# EAGLE schematic cap_pcb (EAGLE 9.6.2)
Assembly variants: basic
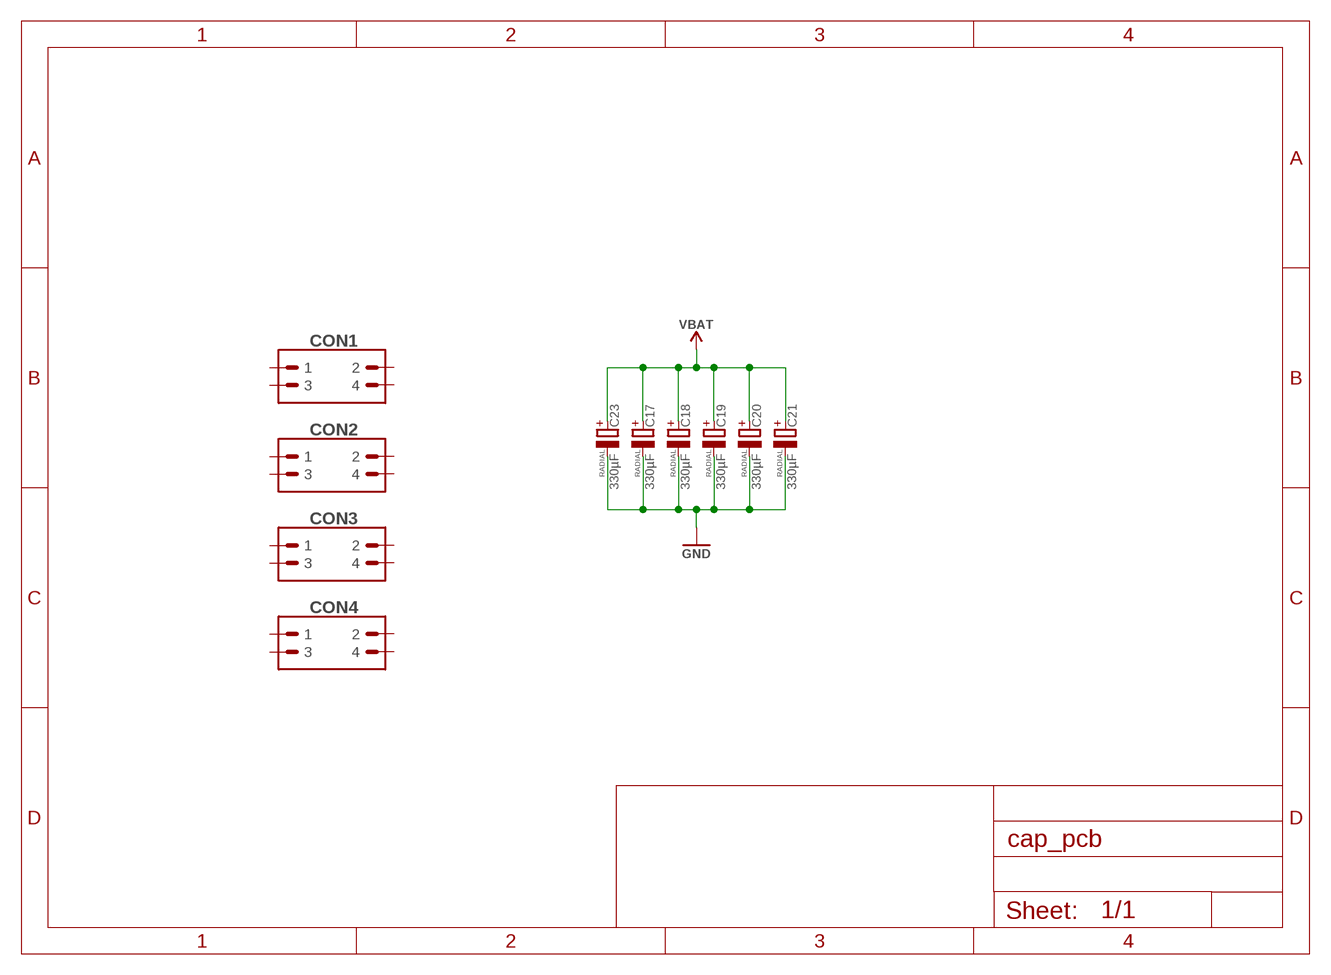
[diagram p0: schematic, sheet 1]

## Parts
C17  330µF  CPOL-RADIAL_SIDE-12.5-22  [RADIAL_SIDE_12.5X22]
C18  330µF  CPOL-RADIAL_SIDE-12.5-22  [RADIAL_SIDE_12.5X22]
C19  330µF  CPOL-RADIAL_SIDE-12.5-22  [RADIAL_SIDE_12.5X22]
C20  330µF  CPOL-RADIAL_SIDE-12.5-22  [RADIAL_SIDE_12.5X22]
C21  330µF  CPOL-RADIAL_SIDE-12.5-22  [RADIAL_SIDE_12.5X22]
C23  330µF  CPOL-RADIAL_SIDE-12.5-22  [RADIAL_SIDE_12.5X22]
CON1  PINHEAD_2X02-PTH-2-MALE  [2X02-PTH-2]
CON2  PINHEAD_2X02-PTH-2-MALE  [2X02-PTH-2]
CON3  PINHEAD_2X02-PTH-2-MALE  [2X02-PTH-2]  (not fitted in variant basic)
CON4  PINHEAD_2X02-PTH-2-MALE  [2X02-PTH-2]

## Nets
GND: C17.- C18.- C19.- C20.- C21.- C23.-
VBAT: C17.+ C18.+ C19.+ C20.+ C21.+ C23.+
Unconnected: CON1.1 CON1.2 CON1.3 CON1.4 CON2.1 CON2.2 CON2.3 CON2.4 CON3.1 CON3.2 CON3.3 CON3.4 CON4.1 CON4.2 CON4.3 CON4.4

## Library data of the parts
C17-C21 C23 = rc:CPOL: Polar tantalum capacitor; DIGIKEY#: 493-4784-3-ND; MANF: Nichicon; MANF#: UCY2C101MHD1TO; PACKAGE: RADIAL; VOLTAGE: 160V
CON1-CON4 = pinhead:PINHEAD_2X02